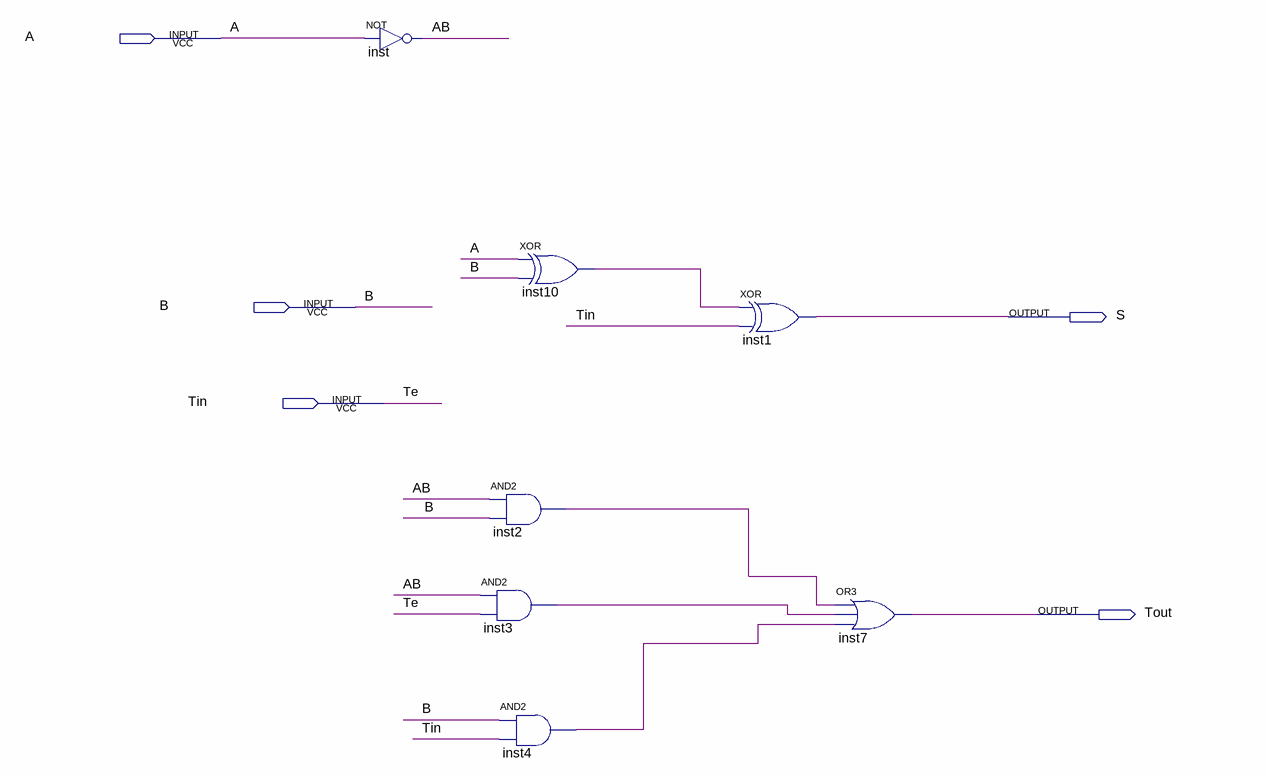
[diagram p0: schematic sheet]
// Quartus schematic Subtratorcompleto.bdf as structural Verilog: 7 symbols, 5 pins
module Subtratorcompleto (
  input  A,
  input  B,
  input  Tin,
  output S,
  output Tout
);

  wire AB, inst2_out, inst3_out, inst4_out, inst10_out;

  not inst (AB, A);
  and inst2 (inst2_out, AB, B);
  and inst3 (inst3_out, AB, Tin);
  xor inst10 (inst10_out, A, B);
  and inst4 (inst4_out, B, Tin);
  xor inst1 (S, inst10_out, Tin);
  or inst7 (Tout, inst2_out, inst3_out, inst4_out);

  // Other names for the same wires on the sheet: Te = Tin
endmodule
